# EAGLE schematic ESP8266_MainBoard (EAGLE 7.3.0)
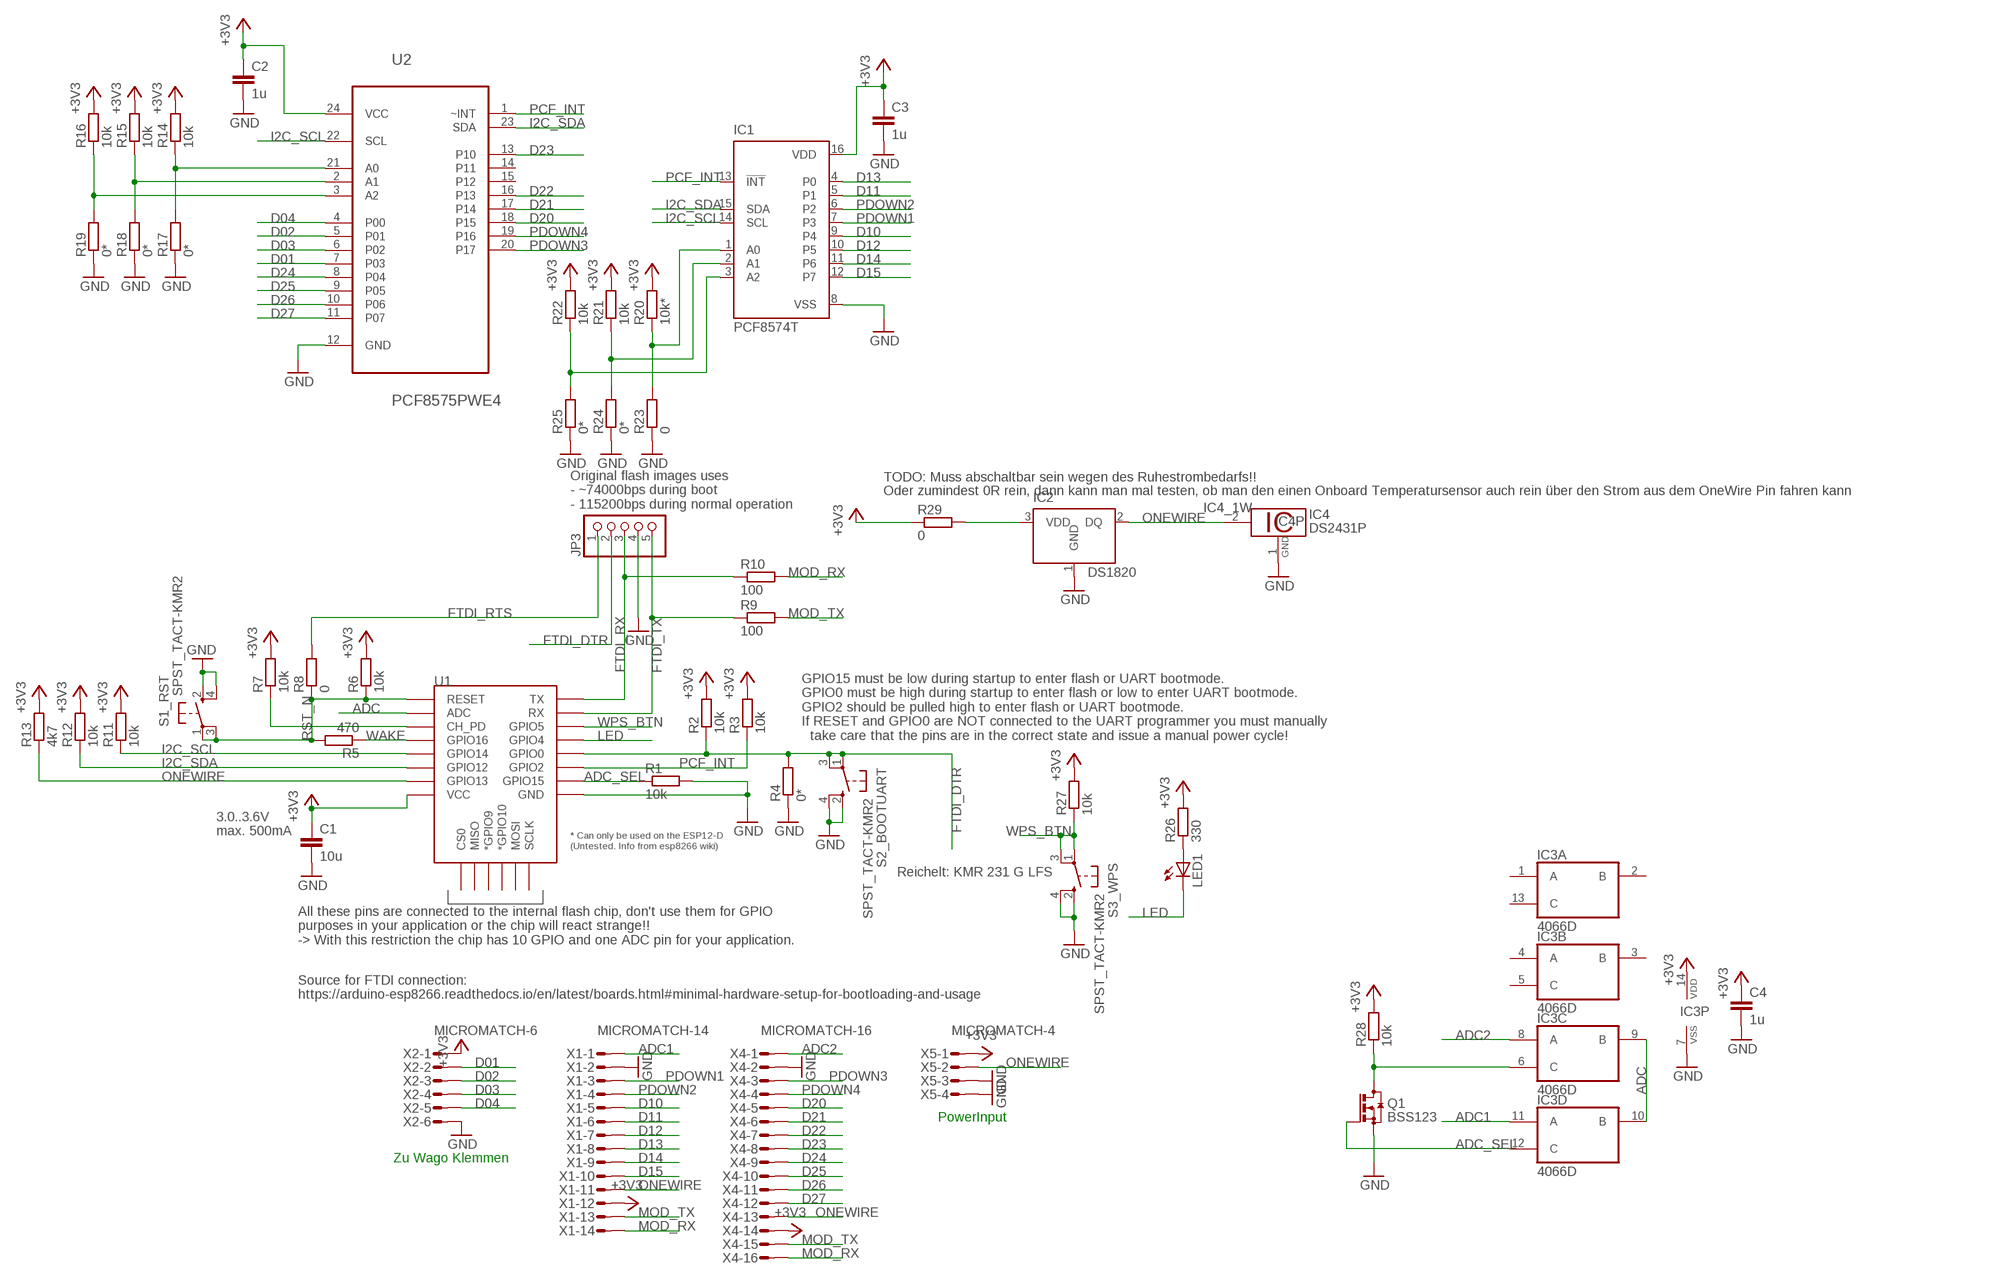
[diagram p0: schematic, sheet 1]

## Parts
C1  10u  C-EUC0805  [C0805]
C2  1u  C-EUC0402  [C0402]
C3  1u  C-EUC0402  [C0402]
C4  1u  C-EUC0402  [C0402]
IC1  PCF8574T  [SO16W]
IC2  DS1820  [TO-92]
IC3  4066D  [SO14]
IC4  DS2431P  [TSOC6]
JP3  PINHD-1X5  [1X05]
LED1  LEDCHIP-LED0603  [CHIP-LED0603]
Q1  BSS123  [SOT23]
R1  10k  R-EU_R0402  [R0402]
R2  10k  R-EU_R0402  [R0402]
R3  10k  R-EU_R0402  [R0402]
R4  0*  R-EU_R0402  [R0402]
R5  470  R-EU_R0402  [R0402]
R6  10k  R-EU_R0402  [R0402]
R7  10k  R-EU_R0402  [R0402]
R8  0  R-EU_R0402  [R0402]
R9  100  R-EU_R0402  [R0402]
R10  100  R-EU_R0402  [R0402]
R11  10k  R-EU_R0402  [R0402]
R12  10k  R-EU_R0402  [R0402]
R13  4k7  R-EU_R0402  [R0402]
R14  10k  R-EU_R0402  [R0402]
R15  10k  R-EU_R0402  [R0402]
R16  10k  R-EU_R0402  [R0402]
R17  0*  R-EU_R0402  [R0402]
R18  0*  R-EU_R0402  [R0402]
R19  0*  R-EU_R0402  [R0402]
R20  10k*  R-EU_R0402  [R0402]
R21  10k  R-EU_R0402  [R0402]
R22  10k  R-EU_R0402  [R0402]
R23  0  R-EU_R0402  [R0402]
R24  0*  R-EU_R0402  [R0402]
R25  0*  R-EU_R0402  [R0402]
R26  330  R-EU_R0402  [R0402]
R27  10k  R-EU_R0402  [R0402]
R28  10k  R-EU_R0402  [R0402]
R29  0  R-EU_R0402  [R0402]
S1_RST  SPST_TACT-KMR2  [KMR2]
S2_BOOTUART  SPST_TACT-KMR2  [KMR2]
S3_WPS  SPST_TACT-KMR2  [KMR2]
U1  ESP12ESMD  [ESP12E-SMD]
U2  PCF8575PWE4  [SOP65P640X120-24N]
X1  MICROMATCH-14  [MICROMATCH-14]
X2  MICROMATCH-6  [MICROMATCH-6]
X4  MICROMATCH-16  [MICROMATCH-16]
X5  MICROMATCH-4  [MICROMATCH-4]

## Nets
+3V3: C1.1 C2.1 C3.1 C4.1 IC1.16(VDD) IC3.14(P:VDD) R2.2 R3.2 R6.2 R7.2 R11.2 R12.2 R13.2 R14.2 R15.2 R16.2 R20.2 R21.2 R22.2 R26.2 R27.2 R28.2 R29.1 U1.VCC U2.24(VCC) X1.12 X2.1 X4.14 X5.1
ADC: IC3.9(C:B) IC3.10(D:B) U1.ADC
ADC1: IC3.11(D:A) X1.1
ADC2: IC3.8(C:A) X4.1
ADC_SEL: IC3.12(D:C) Q1.1(G) R1.1 U1.GPIO15
D01: U2.7(P03) X2.2
D02: U2.5(P01) X2.3
D03: U2.6(P02) X2.4
D04: U2.4(P00) X2.5
D10: IC1.9(P4) X1.5
D11: IC1.5(P1) X1.6
D12: IC1.10(P5) X1.7
D13: IC1.4(P0) X1.8
D14: IC1.11(P6) X1.9
D15: IC1.12(P7) X1.10
D20: U2.18(P15) X4.5
D21: U2.17(P14) X4.6
D22: U2.16(P13) X4.7
D23: U2.13(P10) X4.8
D24: U2.8(P04) X4.9
D25: U2.9(P05) X4.10
D26: U2.10(P06) X4.11
D27: U2.11(P07) X4.12
FTDI_DTR: JP3.2 R2.1 R4.2 S2_BOOTUART.1(P) S2_BOOTUART.3(P1) U1.GPIO0
FTDI_RTS: JP3.1 R8.2
FTDI_RX: JP3.3 R10.1 U1.TXD0(TX)
FTDI_TX: JP3.5 R9.1 U1.RXD0(RX)
GND: C1.2 C2.2 C3.2 C4.2 IC1.8(VSS) IC2.1(GND) IC3.7(P:VSS) IC4.1(GND) JP3.4 Q1.2(S) R1.2 R4.1 R17.1 R18.1 R19.1 R23.1 R24.1 R25.1 S1_RST.2(S) S1_RST.4(S1) S2_BOOTUART.2(S) S2_BOOTUART.4(S1) S3_WPS.2(S) S3_WPS.4(S1) U1.GND U2.12(GND) X1.2 X2.6 X4.2 X5.3 X5.4
I2C_SCL: IC1.14(SCL) R11.1 U1.GPIO14 U2.22(SCL)
I2C_SDA: IC1.15(SDA) R12.1 U1.GPIO12 U2.23(SDA)
LED: LED1.C U1.GPIO4
MOD_RX: R10.2 X1.14 X4.16
MOD_TX: R9.2 X1.13 X4.15
N$1: IC3.6(C:C) Q1.3(D) R28.1
N$2: R14.1 R17.2 U2.21(A0)
N$3: R15.1 R18.2 U2.2(A1)
N$4: R7.1 U1.CH_PD
N$5: IC2.3(VDD) R29.2
N$21: R16.1 R19.2 U2.3(A2)
N$25: IC1.1(A0) R20.1 R23.2
N$26: IC1.2(A1) R21.1 R24.2
N$27: IC1.3(A2) R22.1 R25.2
N$33: LED1.A R26.1
ONEWIRE: IC2.2(DQ) IC4.2(1W) R13.1 U1.GPIO13 X1.11 X4.13 X5.2
PCF_INT: IC1.13(!INT) R3.1 U1.GPIO2 U2.1(~INT)
PDOWN1: IC1.7(P3) X1.3
PDOWN2: IC1.6(P2) X1.4
PDOWN3: U2.20(P17) X4.3
PDOWN4: U2.19(P16) X4.4
RST_N: R5.2 R6.1 R8.1 S1_RST.1(P) S1_RST.3(P1) U1.RESET
WAKE: R5.1 U1.GPIO16
WPS_BTN: R27.1 S3_WPS.1(P) S3_WPS.3(P1) U1.GPIO5
Unconnected: IC3.1(A:A) IC3.2(A:B) IC3.3(B:B) IC3.4(B:A) IC3.5(B:C) IC3.13(A:C) U1.CS0 U1.GPIO9(*GPIO9) U1.GPIO10(*GPIO10) U1.MISO U1.MOSI U1.SCLK U2.14(P11) U2.15(P12)

## Notes on the sheet
- TODO: Muss abschaltbar sein wegen des Ruhestrombedarfs!!
- Oder zumindest 0R rein, dann kann man mal testen, ob man den einen Onboard Temperatursensor auch rein über den Strom aus dem OneWire Pin fahren kann
- Original flash images uses
  - ~74000bps during boot
  - 115200bps during normal operation
- GPIO15 must be low during startup to enter flash or UART bootmode.
  GPIO0 must be high during startup to enter flash or low to enter UART bootmode.
  GPIO2 should be pulled high to enter flash or UART bootmode.
  If RESET and GPIO0 are NOT connected to the UART programmer you must manually
    take care that the pins are in the correct state and issue a manual power cycle!
- 3.0..3.6V
  max. 500mA
- Reichelt: KMR 231 G LFS
- All these pins are connected to the internal flash chip, don't use them for GPIO
  purposes in your application or the chip will react strange!!
  -> With this restriction the chip has 10 GPIO and one ADC pin for your application.
- Source for FTDI connection:
  https://arduino-esp8266.readthedocs.io/en/latest/boards.html#minimal-hardware-setup-for-bootloading-and-usage
- PowerInput
- Zu Wago Klemmen

## Library data of the parts
C1-C4 = rcl:C-EU: CAPACITOR, European symbol
IC1 = micro-philips:PCF8574: I2C-Bus Remote 8-bit I/O expander http://www.semiconductors.philips.com/acrobat_download/datasheets/PCF8574_4.pdf; MPN: PCF8574T/3,512; OC_FARNELL: 1201255; OC_NEWARK: 70R6870
IC2 = DS1820:DS1820: DS1820 - 1-Wire Digital Thermometer
IC3 = 40xx:4066: Quad bilateral ANALOG SWITCH
IC4 = 1wire:DS2431: 1024-Bit EEPROM This chip provides a 4x256 Bit EEPROM, which can be programmed@5V. Write protection and OTP emulation are available, too. Author: Jan Kandziora <jjj@gmx.de>
JP3 = pinhead:PINHD-1X5: PIN HEADER
LED1 = adafruit:LED: LED OSRAM: - CHIPLED LG R971, LG N971, LY N971, LG Q971, LY Q971, LO R971, LY R971 LH N974, LH R974 LS Q976, LO Q976, LY Q976 LO Q996 - Hyper CHIPLED LW Q18S LB Q993, LB Q99A, LB R99A - SideLED LS A670, LO A670, LY A670, LG A670, LP A670 LB A673, LV A673, LT A673, LW A673 LH A674 LY A675 LS A676, LA A676, LO A676, LY A676, LW A676 LS A679, LY A679, LG A679 - Hyper Micro SIDELED® LS Y876, LA Y876, LO Y876, LY Y876 LT Y87S - SmartLED LW L88C, LW L88S LB L89C, LB L89S, LG L890 LS L89K, LO L89K, LY L89K LS L896, LA L896, LO L896, LY L896 - TOPLED LS T670, LO T670, LY T670, LG T670, LP T670 LSG T670, LSP T670, LSY T670, LOP T670, LYG T670 LG T671, LOG T671, LSG T671 LB T673, LV T673, LT T673, LW T673 LH T674 LS T676, LA T676, LO T676, LY T676, LB T676, LH T676, LSB T676, LW T676 LB T67C, LV T67C, LT T67C, LS T67K, LO T67K, LY T67K, LW E67C LS E67B, LA E67B, LO E67B, LY E67B, LB E67C, LV E67C, LT E67C LW T67C LS T679, LY T679, LG T679 LS T770, LO T770, LY T770, LG T770, LP T770 LB T773, LV T773, LT T773, LW T773 LH T774 LS E675, LA E675, LY E675, LS T675 LS T776, LA T776, LO T776, LY T776, LB T776 LHGB T686 LT T68C, LB T68C - Hyper Mini TOPLED® LB M676 - Mini TOPLED Santana® LG M470 LS M47K, LO M47K, LY M47K Source: http://www.osram.convergy.de/
Q1 = transistor-small-signal:BSS123: N-CHANNEL MOS FET
R1-R29 = rcl:R-EU_: RESISTOR, European symbol
S1_RST S2_BOOTUART S3_WPS = adafruit:SPST_TACT: SMT 6mm switch, EVQQ2 series http://www.ladyada.net/library/eagle
U1 = esp8266modules:ESP12E: ESP12E Module
U2 = PCF8575PWE4:PCF8575PWE4: REMOTE 16-BIT I2C AND SMBus I/O EXPANDER; AVAILABILITY: Good; DESCRIPTION: emote 16-Bit I2C and SMBus I/O Expander with Interrupt Output 24-TSSOP -40 to 85; MF: Texas Instruments; MP: PCF8575PWE4; PACKAGE: TSSOP-24 Texas Instruments; PRICE: 1.39 USD
X1 = con-amp-micromatch:MICROMATCH-14: MicroMaTch 14 8-215464-4 / 1-215464-4 Drawing Number C-215464 DDEController.pdf; MF: FARNELL; MPN: 8-215464-4; OC_FARNELL: 3784678; OC_NEWARK: 19J6431
X2 = con-amp-micromatch:MICROMATCH-6: MicroMaTch 6 7-215464-6 / 0-215464-6 Drawing Number C-215464 DDEController.pdf; MPN: 7-215464-6; OC_FARNELL: 3784630; OC_NEWARK: 19R8125
X4 = con-amp-micromatch:MICROMATCH-16: MicroMaTch 16 8-215464-6 / 1-215464-6 Drawing Number C-215464 DDEController.pdf; MF: FARNELL; MPN: 8-215464-6; OC_FARNELL: 3784680; OC_NEWARK: 26H3309
X5 = con-amp-micromatch:MICROMATCH-4: MicroMaTch 4 7-215464-4 / 0-215464-4 Drawing Number C-215464 DDEController.pdf; MPN: 7-215464-4; OC_FARNELL: 3784629; OC_NEWARK: 19R8124